# EAGLE schematic lp (EAGLE 9.4.2)
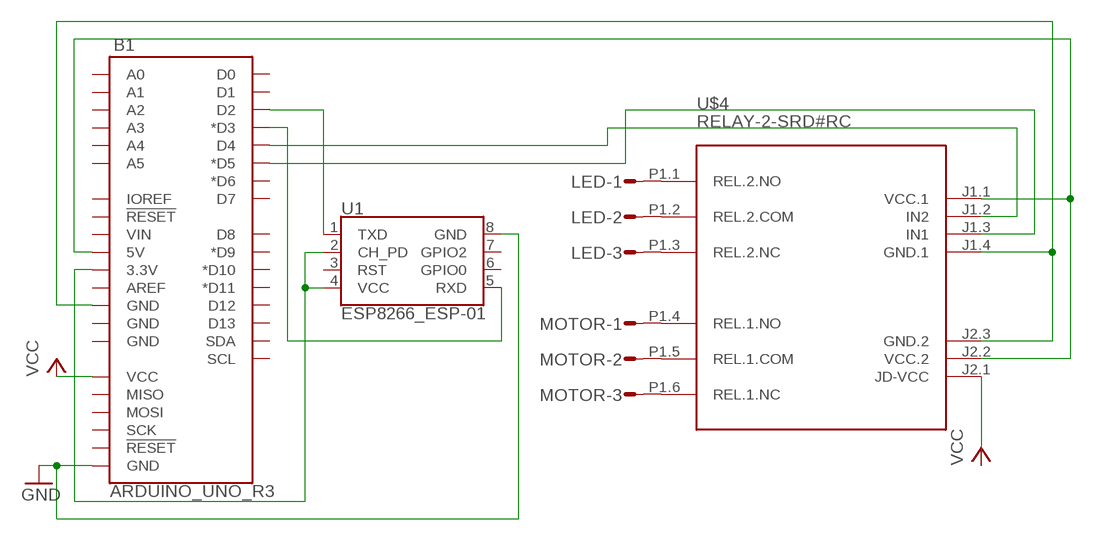
[diagram p0: schematic, sheet 1]

## Parts
B1  ARDUINO_UNO_R3  [ARDUINO_R3]
LED  MT6-3Y  [MT6-3Y]
MOTOR  MT6-3Y  [MT6-3Y]
U1  ESP8266_ESP-01  [ESP8266_ESP-01]
U$4  RELAY-2-SRD#RC  [RELAY-2-SRD#RC]

## Nets
GND: B1.GND@1(GND) U1.8(GND)
N$1: B1.5V U$4.J1.1(VCC.1) U$4.J2.2(VCC.2)
N$2: B1.D2 U1.1(TXD)
N$3: B1.GND@4(GND) U$4.J1.4(GND.1) U$4.J2.3(GND.2)
N$4: B1.D3(*D3) U1.5(RXD)
N$5: B1.D4 U$4.J1.2(IN2)
N$7: B1.3.3V U1.2(CH_PD) U1.4(VCC)
N$8: B1.D5(*D5) U$4.J1.3(IN1)
N$9: LED.1 U$4.P1.1(REL.2.NO)
N$10: LED.2 U$4.P1.2(REL.2.COM)
N$11: LED.3 U$4.P1.3(REL.2.NC)
N$12: MOTOR.1 U$4.P1.4(REL.1.NO)
N$13: MOTOR.2 U$4.P1.5(REL.1.COM)
N$14: MOTOR.3 U$4.P1.6(REL.1.NC)
VCC: B1.VCC U$4.J2.1(JD-VCC)
Unconnected: B1.A0 B1.A1 B1.A2 B1.A3 B1.A4 B1.A5 B1.AREF B1.D0 B1.D1 B1.D6(*D6) B1.D7 B1.D8 B1.D9(*D9) B1.D10(*D10) B1.D11(*D11) B1.D12 B1.D13 B1.GND@2(GND) B1.GND@3(GND) B1.IOREF B1.MISO B1.MOSI B1.RESET@1(!RESET!) B1.RESET@2(!RESET!) B1.SCK B1.SCL B1.SDA B1.VIN U1.3(RST) U1.6(GPIO0) U1.7(GPIO2)

## Library data of the parts
B1 = SparkFun-Boards:ARDUINO_UNO_R3: Arduino R3 Footprint with SPI header Arduino Uno R3 Compatible Footprint. Matches PCB size of the original board. SparkFun Products: SAMD21 Dev Breakout <https://www.sparkfun.com/products/13672> RedBoard <https://www.sparkfun.com/products/12757> R3 Stackable Headers <https://www.sparkfun.com/products/11417>
LED MOTOR = con-amp-mt6:MT6-3Y: AMP MT6 CONNECTOR; OC_FARNELL: unknown; OC_NEWARK: unknown
U1 = SparkFun-RF:ESP8266_ESP-01: ESP8266 ESP-01 Module The ESP8266 WiFi Module is a self contained SOC with integrated TCP/IP protocol stack that can give any microcontroller access to your WiFi network. The ESP8266 is capable of either hosting an application or offloading all Wi-Fi networking functions from another application processor. Each ESP8266 module comes pre-programmed with an AT command set firmware, meaning, you can simply hook this up to your Arduino device and get about as much WiFi-ability as a WiFi Shield offers (and that’s just out of the box)! The ESP8266 module is an extremely cost effective board with a huge, and ever growing, community. This module has a powerful enough on-board processing and storage capability that allows it to be integrated with the sensors and other application specific devices through its GPIOs with minimal development up-front and minimal loading during runtime. Its high degree of on-chip integration allows for minimal external circuitry, including the front-end module, is designed to occupy minimal PCB area. The ESP8266 supports APSD for VoIP applications and Bluetooth co-existance interfaces, it contains a self-calibrated RF allowing it to work under all operating conditions, and requires no external RF parts. SparkFun Product Page <https://www.sparkfun.com/products/13678>; SF_ID: WRL-13678
U$4 = diy-modules:RELAY-2-SRD#RC: 2-Channel Relay Module based on SRD-05VDC-SL-C relays Symbol with relays pins Click here to find device on ebay.com <http://www.ebay.com/sch/two+channel+relay+module+optocoupler+5v>